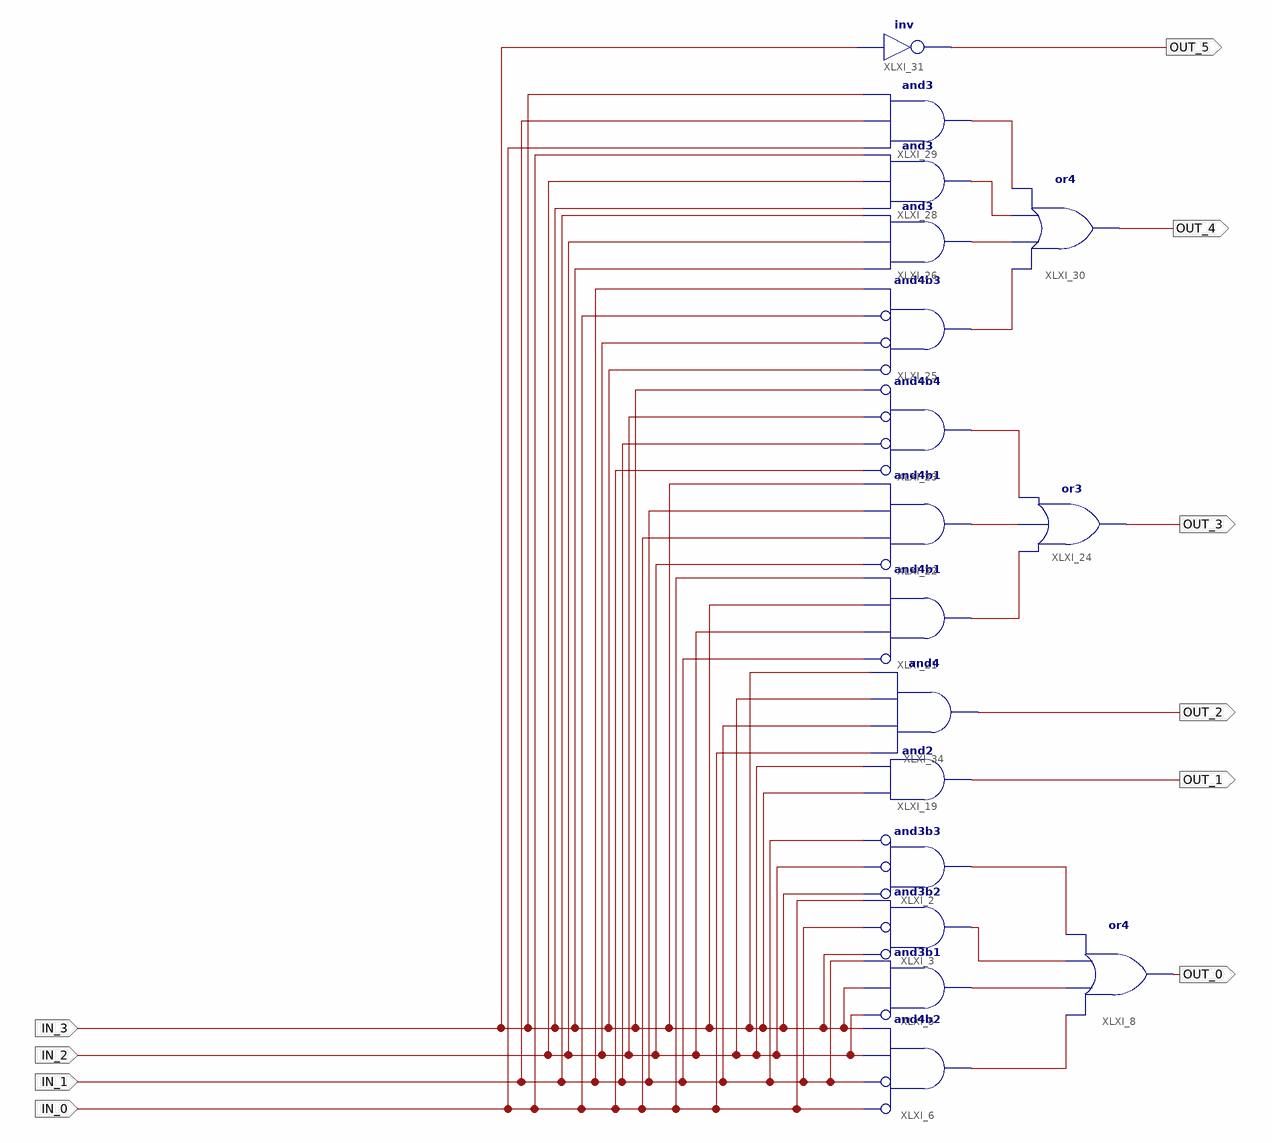
[diagram p0: schematic sheet 1]
// Xilinx ISE schematic My4To6Decoder.sch (spartan3a) as structural Verilog: 17 symbols, 10 ports
module My4To6Decoder (
  input  IN_0,
  input  IN_1,
  input  IN_2,
  input  IN_3,
  output OUT_0,
  output OUT_1,
  output OUT_3,
  output OUT_4,
  output OUT_5,
  output OUT_2
);

  wire XLXN_4, XLXN_5, XLXN_6, XLXN_7, XLXN_61, XLXN_62, XLXN_63, XLXN_70, XLXN_71, XLXN_72, XLXN_73;

  and XLXI_3 (XLXN_5, ~IN_3, ~IN_1, IN_0);  // and3b2
  and XLXI_5 (XLXN_6, ~IN_2, IN_3, IN_1);  // and3b1
  and XLXI_6 (XLXN_7, ~IN_0, ~IN_1, IN_2, IN_3);  // and4b2
  and XLXI_2 (XLXN_4, ~IN_3, ~IN_2, ~IN_1);  // and3b3
  or XLXI_8 (OUT_0, XLXN_7, XLXN_6, XLXN_5, XLXN_4);
  and XLXI_19 (OUT_1, IN_3, IN_2);
  and XLXI_21 (XLXN_63, ~IN_1, IN_2, IN_3, IN_0);  // and4b1
  and XLXI_22 (XLXN_62, ~IN_2, IN_0, IN_1, IN_3);  // and4b1
  and XLXI_23 (XLXN_61, ~IN_0, ~IN_1, ~IN_2, ~IN_3);  // and4b4
  or XLXI_24 (OUT_3, XLXN_63, XLXN_62, XLXN_61);
  and XLXI_25 (XLXN_70, ~IN_3, ~IN_2, ~IN_0, IN_1);  // and4b3
  and XLXI_26 (XLXN_71, IN_3, IN_2, IN_1);
  and XLXI_28 (XLXN_72, IN_3, IN_2, IN_0);
  and XLXI_29 (XLXN_73, IN_0, IN_1, IN_3);
  or XLXI_30 (OUT_4, XLXN_70, XLXN_71, XLXN_72, XLXN_73);
  not XLXI_31 (OUT_5, IN_3);
  and XLXI_34 (OUT_2, IN_0, IN_1, IN_2, IN_3);
endmodule
